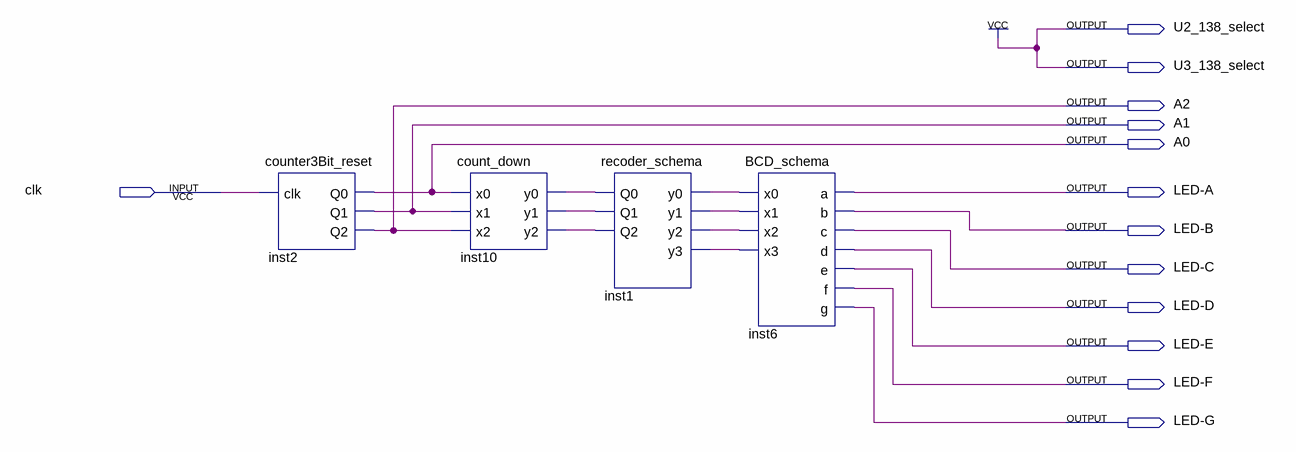
[diagram p0: schematic sheet]
// Quartus schematic main_copy.bdf as structural Verilog: 4 symbols, 13 pins
module main_copy (
  input  clk,
  output U2_138_select,
  output U3_138_select,
  output A2,
  output A1,
  output A0,
  output \LED-A ,
  output \LED-B ,
  output \LED-C ,
  output \LED-D ,
  output \LED-E ,
  output \LED-F ,
  output \LED-G 
);

  wire inst1_y0, inst1_y1, inst1_y2, inst1_y3, inst10_y0, inst10_y1, inst10_y2;

  counter3Bit_reset inst2 (.clk(clk), .Q0(A0), .Q1(A1), .Q2(A2));
  count_down inst10 (.x0(A0), .x1(A1), .x2(A2), .y0(inst10_y0), .y1(inst10_y1), .y2(inst10_y2));
  recoder_schema inst1 (
    .Q0(inst10_y0), .Q1(inst10_y1), .Q2(inst10_y2), .y0(inst1_y0), .y1(inst1_y1), .y2(inst1_y2), .y3(inst1_y3));
  BCD_schema inst6 (
    .x0(inst1_y0), .x1(inst1_y1), .x2(inst1_y2), .x3(inst1_y3), .a(\LED-A ), .b(\LED-B ), .c(\LED-C ),
    .d(\LED-D ), .e(\LED-E ), .f(\LED-F ), .g(\LED-G ));

  assign U2_138_select = 1'b1;
  assign U3_138_select = 1'b1;
endmodule
